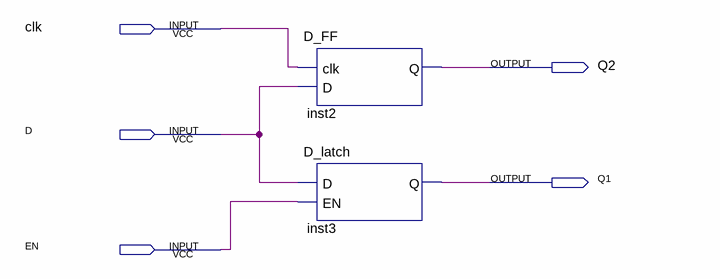
[diagram p0: schematic sheet]
// Quartus schematic D_LF.bdf as structural Verilog: 2 symbols, 5 pins
module D_LF (
  input  clk,
  input  D,
  input  EN,
  output Q2,
  output Q1
);

  D_FF inst2 (.clk(clk), .D(D), .Q(Q2));
  D_latch inst3 (.D(D), .EN(EN), .Q(Q1));
endmodule
